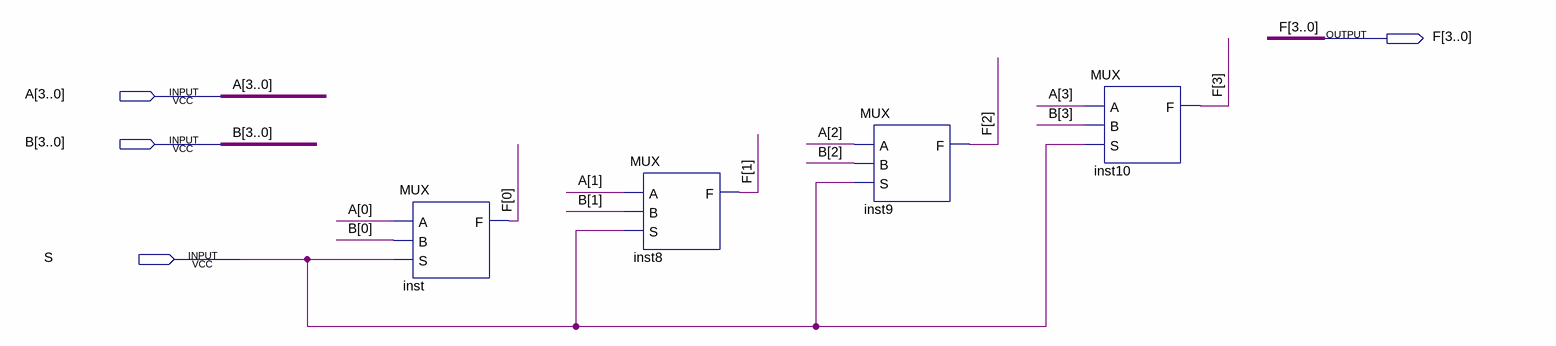
[diagram p0: schematic sheet]
// Quartus schematic multiplexer.bdf as structural Verilog: 4 symbols, 4 pins
module multiplexer (
  input  [3:0] A,
  input  [3:0] B,
  input  S,
  output [3:0] F
);

  MUX inst (.A(A[0]), .B(B[0]), .S(S), .F(F[0]));
  MUX inst8 (.A(A[1]), .B(B[1]), .S(S), .F(F[1]));
  MUX inst9 (.A(A[2]), .B(B[2]), .S(S), .F(F[2]));
  MUX inst10 (.A(A[3]), .B(B[3]), .S(S), .F(F[3]));
endmodule
